# EAGLE schematic board (EAGLE 9.4.2)

## Sheet 1 of 5: Logika a konektory -ESP32 -konektor na GPS, motor zamku, vivod i2c a zbyle pinhedy pro externi pouyiti
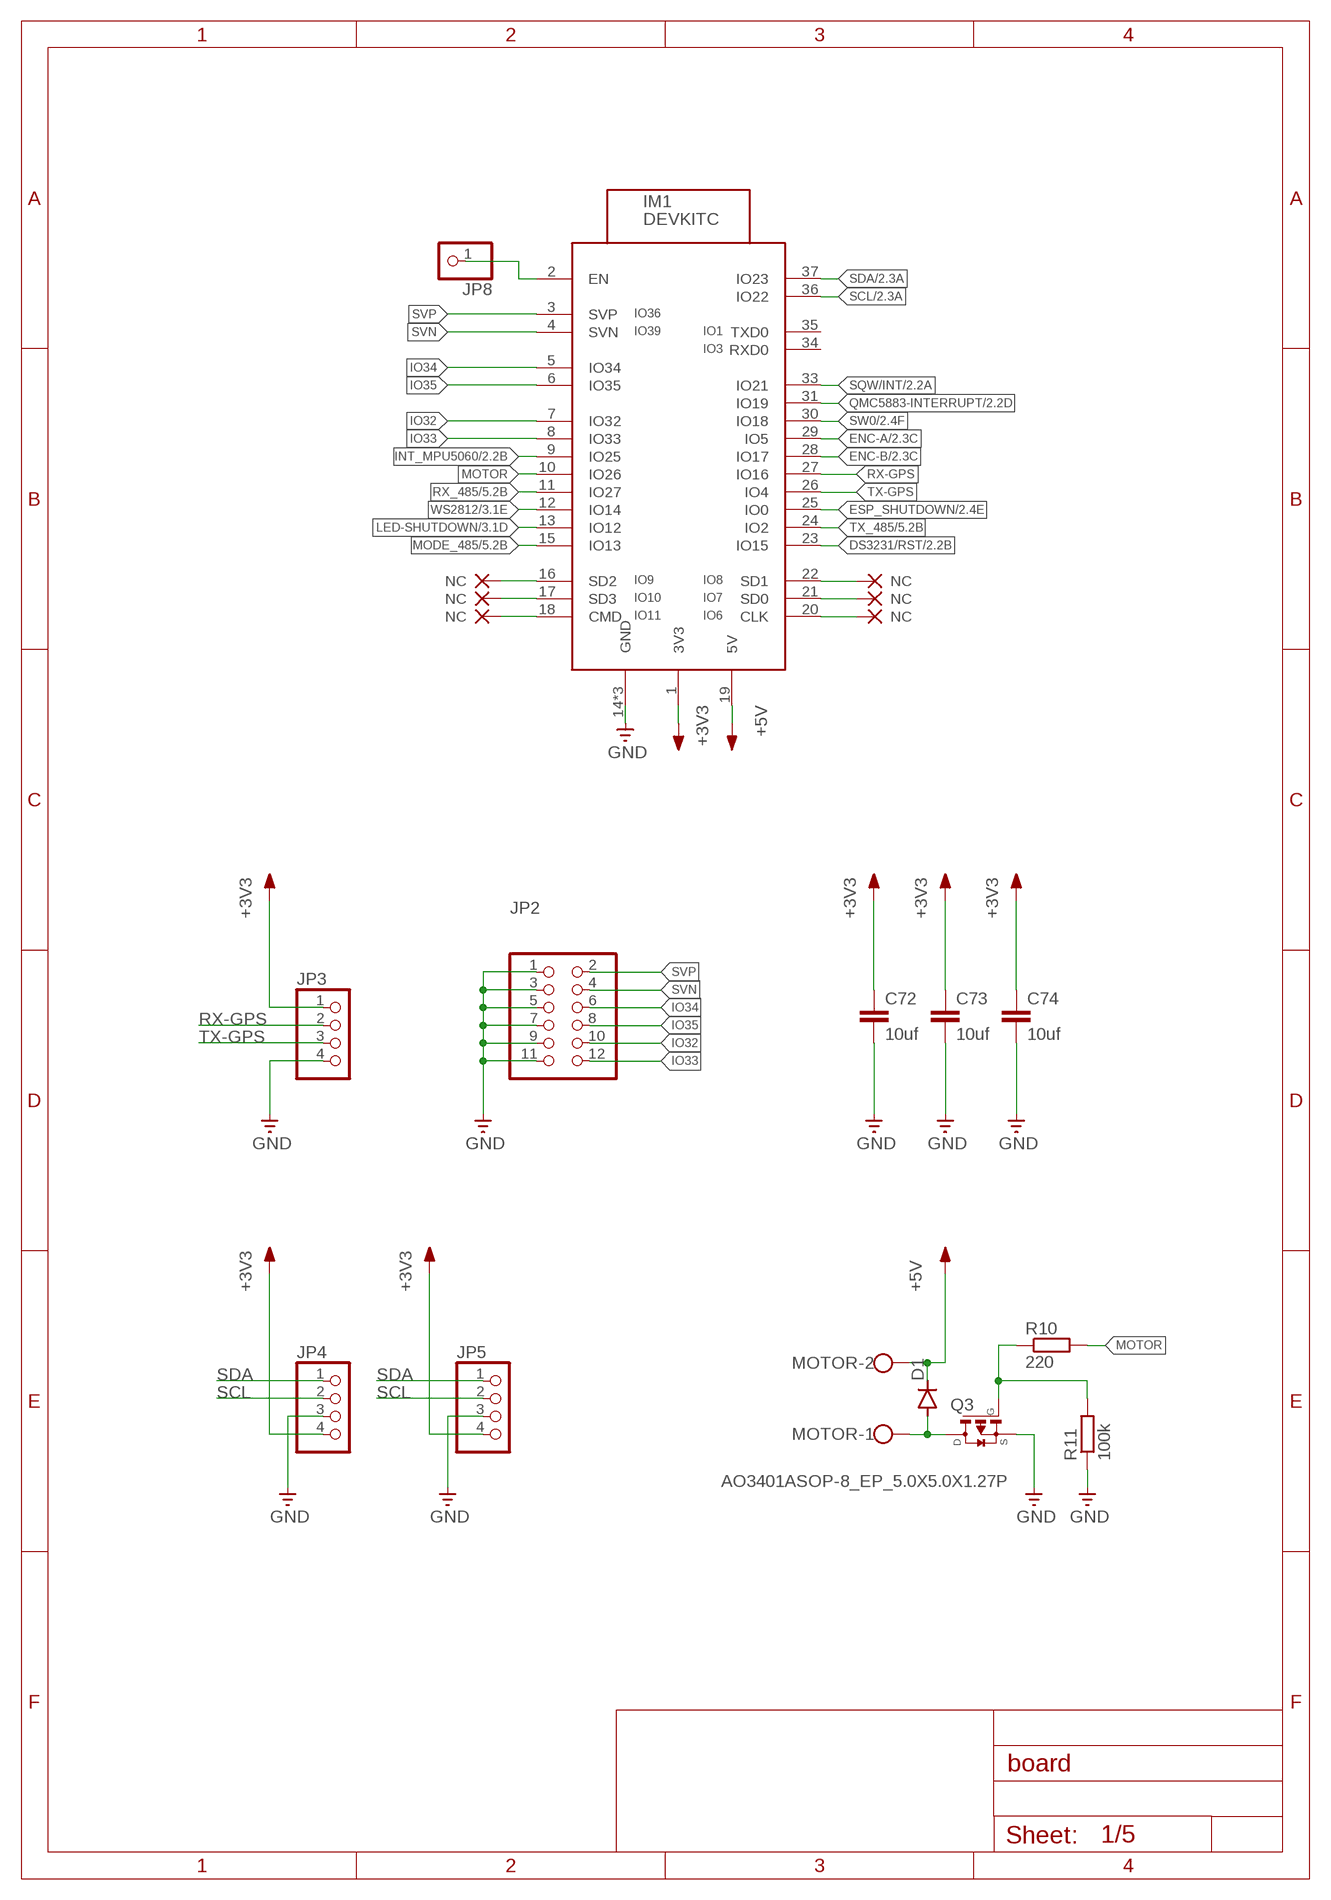
[diagram p0: schematic, sheet 1]

### Parts
C72  10uf  C-EUC0402  [C0402]
C73  10uf  C-EUC0402  [C0402]
C74  10uf  C-EUC0402  [C0402]
D1  DIODE-DO214BA  [DO214BA]
IM1  DEVKITC  [DEVKITC]
JP2  PINHD-2X6  [2X06]
JP3  PINHD-1X4  [1X04]
JP4  PINHD-1X4  [1X04]
JP5  PINHD-1X4  [1X04]
JP8  PINHD-1X1  [1X01]
MOTOR  W237-102  [W237-102]
NC1  NC  (no package)
NC2  NC  (no package)
NC3  NC  (no package)
NC4  NC  (no package)
NC5  NC  (no package)
NC6  NC  (no package)
Q3  AO3401ASOP-8_EP_5.0X5.0X1.27P  [SOP-8_EP_5.0X5.0X1.27P]
R10  220  R-EU_R0402  [R0402]
R11  100k  R-EU_R0402  [R0402]

### Nets
+3V3: C72.1 C73.1 C74.1 IM1.1(3V3) JP3.1 JP4.4 JP5.4 ; also sheet 2,3,5
+5V: D1.C IM1.19(5V) MOTOR.2 ; also sheet 2,3,5
DS3231/RST: IM1.23(IO15) ; also sheet 2
ENC-A: IM1.29(IO5) ; also sheet 2
ENC-B: IM1.28(IO17) ; also sheet 2
ESP_SHUTDOWN: IM1.25(IO0) ; also sheet 2
GND: C72.2 C73.2 C74.2 IM1.14(GND) IM1.32(GND) IM1.38(GND) JP2.1 JP2.3 JP2.5 JP2.7 JP2.9 JP2.11 JP3.4 JP4.3 JP5.3 Q3.1(S) Q3.2(S) Q3.3(S) R11.1 ; also sheet 2,3,4,5
INT_MPU5060: IM1.9(IO25) ; also sheet 2
IO9_NC: IM1.16(SD2) NC1.NC
IO9_NC1: IM1.20(CLK) NC4.NC
IO10_NC: IM1.17(SD3) NC2.NC
IO10_NC1: IM1.21(SD0) NC5.NC
IO11_NC: IM1.18(CMD) NC3.NC
IO11_NC1: IM1.22(SD1) NC6.NC
IO32: IM1.7(IO32) JP2.10
IO33: IM1.8(IO33) JP2.12
IO34: IM1.5(IO34) JP2.6
IO35: IM1.6(IO35) JP2.8
LED-SHUTDOWN: IM1.13(IO12) ; also sheet 3
MODE_485: IM1.15(IO13) ; also sheet 5
MOTOR: IM1.10(IO26) R10.2
N$2: D1.A MOTOR.1 Q3.5(D) Q3.6(D) Q3.7(D) Q3.8(D) Q3.9(D)
N$10: IM1.2(EN) JP8.1
N$71: Q3.4(G) R10.1 R11.2
QMC5883-INTERRUPT: IM1.31(IO19) ; also sheet 2
RX-GPS: IM1.27(IO16) JP3.2
RX_485: IM1.11(IO27) ; also sheet 5
SCL: IM1.36(IO22) JP4.2 JP5.2 ; also sheet 2
SDA: IM1.37(IO23) JP4.1 JP5.1 ; also sheet 2
SQW/INT: IM1.33(IO21) ; also sheet 2
SVN: IM1.4(SVN) JP2.4
SVP: IM1.3(SVP) JP2.2
SW0: IM1.30(IO18) ; also sheet 2
TX-GPS: IM1.26(IO4) JP3.3
TX_485: IM1.24(IO2) ; also sheet 5
WS2812: IM1.12(IO14) ; also sheet 3
Unconnected: IM1.34(RXD0) IM1.35(TXD0)

## Sheet 2 of 5
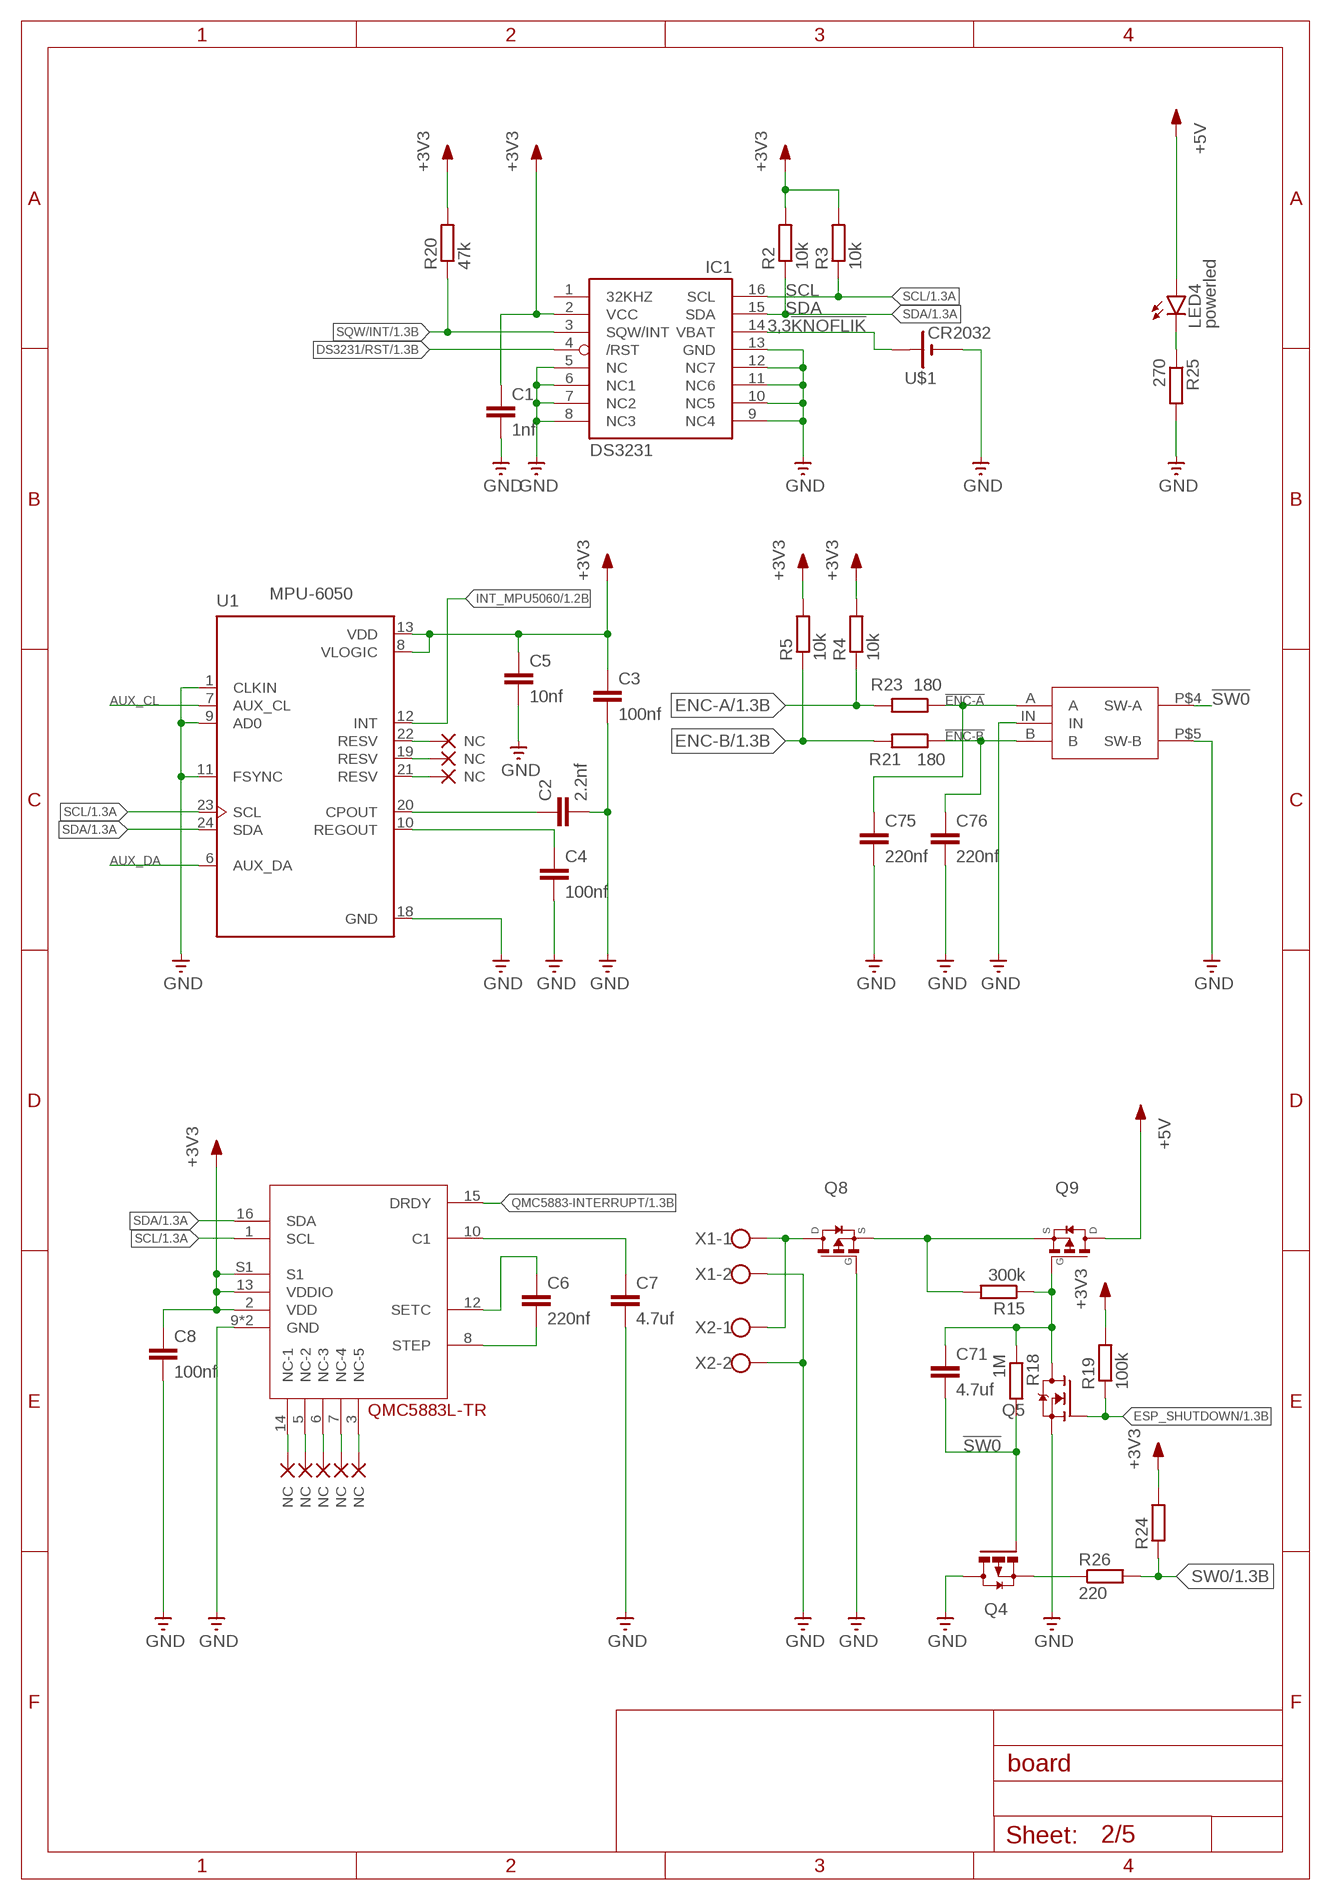
[diagram p1: schematic, sheet 2]

### Parts
C1  1nf  C-EUC0402  [C0402]
C2  2.2nf  C-EUC0402  [C0402]
C3  100nf  C-EUC0402  [C0402]
C4  100nf  C-EUC0402K  [C0402K]
C5  10nf  C-EUC0402  [C0402]
C6  220nf  C-EUC0402  [C0402]
C7  4.7uf  C-EUC0402  [C0402]
C8  100nf  C-EU  [C0402P]
C71  4.7uf  C-EUC0603  [C0603]
C75  220nf  C-EUC0402  [C0402]
C76  220nf  C-EUC0402  [C0402]
IC1  DS3231/SO  [SO16W]
IC2  QMC5883L-TR  [QMC5882L-TR]
LED4  powerled  LEDSML0603  [SML0603]
NC7  NC  (no package)
NC8  NC  (no package)
NC9  NC  (no package)
NC10  NC  (no package)
NC11  NC  (no package)
NC13  NC  (no package)
NC14  NC  (no package)
NC15  NC  (no package)
Q4  BSS84  [SOT23]
Q5  N-MOSFET-SOT23-GSD  [SOT23]
Q8  AO3401ASOP-8_EP_5.0X5.0X1.27P  [SOP-8_EP_5.0X5.0X1.27P]
Q9  AO3401ASOP-8_EP_5.0X5.0X1.27P  [SOP-8_EP_5.0X5.0X1.27P]
R2  10k  R-EU_R0402  [R0402]
R3  10k  R-EU_R0402  [R0402]
R4  10k  R-EU_R0402  [R0402]
R5  10k  R-EU_R0402  [R0402]
R15  300k  R-EU_R0603  [R0603]
R18  1M  R-EU_R0603  [R0603]
R19  100k  R-EU_R0402  [R0402]
R20  47k  R-EU_R0402  [R0402]
R21  180  R-EU_R0402  [R0402]
R23  180  R-EU_R0402  [R0402]
R24  47k  R-EU_R0402  [R0402]
R25  270  R-EU_R0402  [R0402]
R26  220  R-EU_R0402  [R0402]
U1  MPU-6050  [QFN50P400X400X95-24N]
U$1  CR2032  [CH075]
U$62  EC11-1S  [EC11-1S]
X1  W237-102  [W237-102]
X2  W237-102  [W237-102]

### Nets
3,3!KNOFLIK: IC1.14(VBAT) U$1.+
!ENC-A: C75.1 R23.1 U$62.A
!ENC-B: C76.1 R21.1 U$62.B
!SW0: C71.2 Q4.1(G) R18.2 U$62.P$4(SW-A)
+3V3: C1.1 C3.1 C5.1 C8.1 IC1.2(VCC) IC2.2(VDD) IC2.13(VDDIO) IC2.S1 R2.2 R3.2 R4.2 R5.2 R19.2 R20.2 R24.2 U1.8(VLOGIC) U1.13(VDD) ; also sheet 1,3,5
+5V: LED4.A Q9.5(D) Q9.6(D) Q9.7(D) Q9.8(D) Q9.9(D) ; also sheet 1,3,5
AUX_CL: U1.7(AUX_CL)
AUX_DA: U1.6(AUX_DA)
DS3231/RST: IC1.4(/RST) ; also sheet 1
ENC-A: R4.1 R23.2 ; also sheet 1
ENC-B: R5.1 R21.2 ; also sheet 1
ESP_SHUTDOWN: Q5.1(G) R19.1 ; also sheet 1
GND: C1.2 C2.2 C3.2 C4.2 C5.2 C7.2 C8.2 C75.2 C76.2 IC1.5(NC) IC1.6(NC1) IC1.7(NC2) IC1.8(NC3) IC1.9(NC4) IC1.10(NC5) IC1.11(NC6) IC1.12(NC7) IC1.13(GND) IC2.9(GND) IC2.11(GND) Q4.3(D) Q5.2(S) Q8.4(G) R25.2 U1.1(CLKIN) U1.9(AD0) U1.11(FSYNC) U1.18(GND) U$1.- U$62.IN U$62.P$5(SW-B) X1.2 X2.2 ; also sheet 1,3,4,5
INT_MPU5060: U1.12(INT) ; also sheet 1
IO9_NC2: IC2.5(NC-2) NC7.NC
IO9_NC3: IC2.14(NC-1) NC10.NC
IO9_NC4: NC8.NC U1.19(RESV)
IO9_NC5: NC14.NC U1.21(RESV)
IO9_NC6: IC2.3(NC-5) NC11.NC
IO9_NC7: IC2.7(NC-4) NC15.NC
IO10_NC2: IC2.6(NC-3) NC9.NC
IO10_NC4: NC13.NC U1.22(RESV)
LED4: LED4.C R25.1
N$1: C2.1 U1.20(CPOUT)
N$3: C4.1 U1.10(REGOUT)
N$4: Q8.5(D) Q8.6(D) Q8.7(D) Q8.8(D) Q8.9(D) X1.1 X2.1
N$5: Q8.1(S) Q8.2(S) Q8.3(S) Q9.1(S) Q9.2(S) Q9.3(S) R15.2
N$6: C71.1 Q5.3(D) Q9.4(G) R15.1 R18.1
N$7: Q4.2(S) R26.1
N$60: C6.1 IC2.12(SETC)
N$62: C6.2 IC2.8(STEP)
N$66: C7.1 IC2.10(C1)
QMC5883-INTERRUPT: IC2.15(DRDY) ; also sheet 1
SCL: IC1.16(SCL) IC2.1(SCL) R3.1 U1.23(SCL) ; also sheet 1
SDA: IC1.15(SDA) IC2.16(SDA) R2.1 U1.24(SDA) ; also sheet 1
SQW/INT: IC1.3(SQW/INT) R20.1 ; also sheet 1
SW0: R24.1 R26.2 ; also sheet 1
Unconnected: IC1.1(32KHZ)

## Sheet 3 of 5
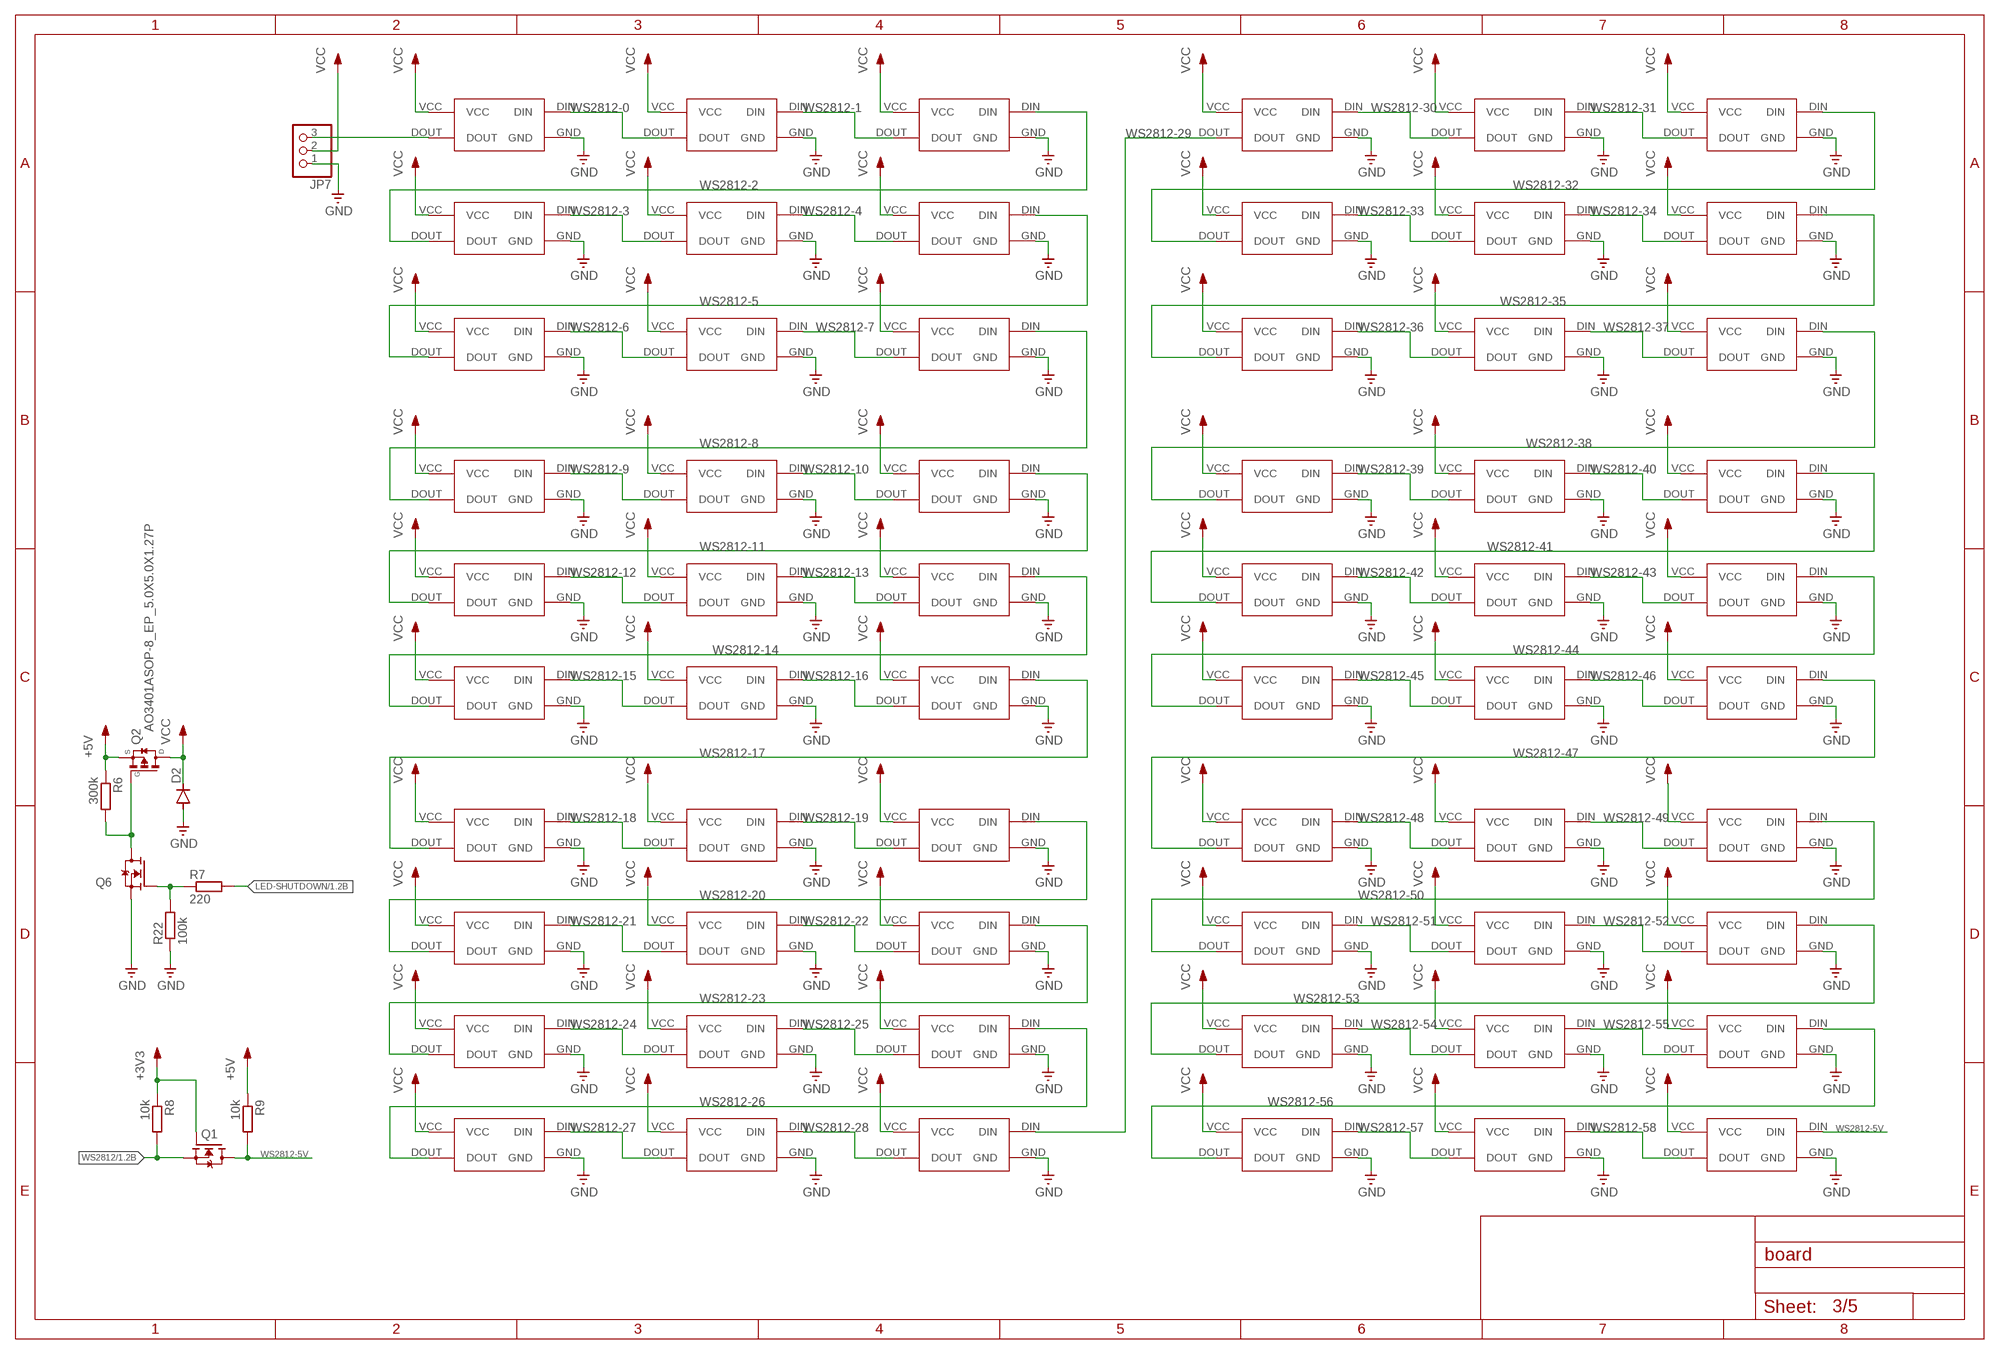
[diagram p2: schematic, sheet 3]

### Parts
D2  DIODE-DO214BA  [DO214BA]
JP7  PINHD-1X3  [1X03]
Q1  N-MOSFET-SOT23-GSD  [SOT23]
Q2  AO3401ASOP-8_EP_5.0X5.0X1.27P  [SOP-8_EP_5.0X5.0X1.27P]
Q6  N-MOSFET-SOT23-GSD  [SOT23]
R6  300k  R-EU_R0402  [R0402]
R7  220  R-EU_R0402  [R0402]
R8  10k  R-EU_R0402  [R0402]
R9  10k  R-EU_R0402  [R0402]
R22  100k  R-EU_R0402  [R0402]
U$2  WS2812  [WS2812B-MINI]
U$3  WS2812  [WS2812B-MINI]
U$4  WS2812  [WS2812B-MINI]
U$5  WS2812  [WS2812B-MINI]
U$6  WS2812  [WS2812B-MINI]
U$7  WS2812  [WS2812B-MINI]
U$8  WS2812  [WS2812B-MINI]
U$9  WS2812  [WS2812B-MINI]
U$10  WS2812  [WS2812B-MINI]
U$11  WS2812  [WS2812B-MINI]
U$12  WS2812  [WS2812B-MINI]
U$13  WS2812  [WS2812B-MINI]
U$14  WS2812  [WS2812B-MINI]
U$15  WS2812  [WS2812B-MINI]
U$16  WS2812  [WS2812B-MINI]
U$17  WS2812  [WS2812B-MINI]
U$18  WS2812  [WS2812B-MINI]
U$19  WS2812  [WS2812B-MINI]
U$20  WS2812  [WS2812B-MINI]
U$21  WS2812  [WS2812B-MINI]
U$22  WS2812  [WS2812B-MINI]
U$23  WS2812  [WS2812B-MINI]
U$24  WS2812  [WS2812B-MINI]
U$25  WS2812  [WS2812B-MINI]
U$26  WS2812  [WS2812B-MINI]
U$27  WS2812  [WS2812B-MINI]
U$28  WS2812  [WS2812B-MINI]
U$29  WS2812  [WS2812B-MINI]
U$30  WS2812  [WS2812B-MINI]
U$31  WS2812  [WS2812B-MINI]
U$32  WS2812  [WS2812B-MINI]
U$33  WS2812  [WS2812B-MINI]
U$34  WS2812  [WS2812B-MINI]
U$35  WS2812  [WS2812B-MINI]
U$36  WS2812  [WS2812B-MINI]
U$37  WS2812  [WS2812B-MINI]
U$38  WS2812  [WS2812B-MINI]
U$39  WS2812  [WS2812B-MINI]
U$40  WS2812  [WS2812B-MINI]
U$41  WS2812  [WS2812B-MINI]
U$42  WS2812  [WS2812B-MINI]
U$43  WS2812  [WS2812B-MINI]
U$44  WS2812  [WS2812B-MINI]
U$45  WS2812  [WS2812B-MINI]
U$46  WS2812  [WS2812B-MINI]
U$47  WS2812  [WS2812B-MINI]
U$48  WS2812  [WS2812B-MINI]
U$49  WS2812  [WS2812B-MINI]
U$50  WS2812  [WS2812B-MINI]
U$51  WS2812  [WS2812B-MINI]
U$52  WS2812  [WS2812B-MINI]
U$53  WS2812  [WS2812B-MINI]
U$54  WS2812  [WS2812B-MINI]
U$55  WS2812  [WS2812B-MINI]
U$56  WS2812  [WS2812B-MINI]
U$57  WS2812  [WS2812B-MINI]
U$58  WS2812  [WS2812B-MINI]
U$59  WS2812  [WS2812B-MINI]
U$60  WS2812  [WS2812B-MINI]
U$61  WS2812  [WS2812B-MINI]

### Nets
+3V3: Q1.1(G) R8.1 ; also sheet 1,2,5
+5V: Q2.1(S) Q2.2(S) Q2.3(S) R6.1 R9.1 ; also sheet 1,2,5
GND: D2.A JP7.1 Q6.2(S) R22.1 U$2.GND U$3.GND U$4.GND U$5.GND U$6.GND U$7.GND U$8.GND U$9.GND U$10.GND U$11.GND U$12.GND U$13.GND U$14.GND U$15.GND U$16.GND U$17.GND U$18.GND U$19.GND U$20.GND U$21.GND U$22.GND U$23.GND U$24.GND U$25.GND U$26.GND U$27.GND U$28.GND U$29.GND U$30.GND U$31.GND U$32.GND U$33.GND U$34.GND U$35.GND U$36.GND U$37.GND U$38.GND U$39.GND U$40.GND U$41.GND U$42.GND U$43.GND U$44.GND U$45.GND U$46.GND U$47.GND U$48.GND U$49.GND U$50.GND U$51.GND U$52.GND U$53.GND U$54.GND U$55.GND U$56.GND U$57.GND U$58.GND U$59.GND U$60.GND U$61.GND ; also sheet 1,2,4,5
LED-SHUTDOWN: R7.2 ; also sheet 1
N$9: JP7.3 U$2.DOUT
N$47: U$49.DIN U$50.DOUT
N$68: Q2.4(G) Q6.3(D) R6.2
N$69: Q6.1(G) R7.1 R22.2
VCC: D2.C JP7.2 Q2.5(D) Q2.6(D) Q2.7(D) Q2.8(D) Q2.9(D) U$2.VCC U$3.VCC U$4.VCC U$5.VCC U$6.VCC U$7.VCC U$8.VCC U$9.VCC U$10.VCC U$11.VCC U$12.VCC U$13.VCC U$14.VCC U$15.VCC U$16.VCC U$17.VCC U$18.VCC U$19.VCC U$20.VCC U$21.VCC U$22.VCC U$23.VCC U$24.VCC U$25.VCC U$26.VCC U$27.VCC U$28.VCC U$29.VCC U$30.VCC U$31.VCC U$32.VCC U$33.VCC U$34.VCC U$35.VCC U$36.VCC U$37.VCC U$38.VCC U$39.VCC U$40.VCC U$41.VCC U$42.VCC U$43.VCC U$44.VCC U$45.VCC U$46.VCC U$47.VCC U$48.VCC U$49.VCC U$50.VCC U$51.VCC U$52.VCC U$53.VCC U$54.VCC U$55.VCC U$56.VCC U$57.VCC U$58.VCC U$59.VCC U$60.VCC U$61.VCC ; also sheet 4
WS2812: Q1.2(S) R8.2 ; also sheet 1
WS2812-0: U$2.DIN U$3.DOUT
WS2812-1: U$3.DIN U$4.DOUT
WS2812-2: U$4.DIN U$5.DOUT
WS2812-3: U$5.DIN U$6.DOUT
WS2812-4: U$6.DIN U$7.DOUT
WS2812-5: U$7.DIN U$8.DOUT
WS2812-5V: Q1.3(D) R9.2 U$61.DIN
WS2812-6: U$8.DIN U$9.DOUT
WS2812-7: U$9.DIN U$10.DOUT
WS2812-8: U$10.DIN U$11.DOUT
WS2812-9: U$11.DIN U$12.DOUT
WS2812-10: U$12.DIN U$13.DOUT
WS2812-11: U$13.DIN U$14.DOUT
WS2812-12: U$14.DIN U$15.DOUT
WS2812-13: U$15.DIN U$16.DOUT
WS2812-14: U$16.DIN U$17.DOUT
WS2812-15: U$17.DIN U$18.DOUT
WS2812-16: U$18.DIN U$19.DOUT
WS2812-17: U$19.DIN U$20.DOUT
WS2812-18: U$20.DIN U$21.DOUT
WS2812-19: U$21.DIN U$22.DOUT
WS2812-20: U$22.DIN U$23.DOUT
WS2812-21: U$23.DIN U$24.DOUT
WS2812-22: U$24.DIN U$25.DOUT
WS2812-23: U$25.DIN U$26.DOUT
WS2812-24: U$26.DIN U$27.DOUT
WS2812-25: U$27.DIN U$28.DOUT
WS2812-26: U$28.DIN U$29.DOUT
WS2812-27: U$29.DIN U$30.DOUT
WS2812-28: U$30.DIN U$31.DOUT
WS2812-29: U$31.DIN U$32.DOUT
WS2812-30: U$32.DIN U$33.DOUT
WS2812-31: U$33.DIN U$34.DOUT
WS2812-32: U$34.DIN U$35.DOUT
WS2812-33: U$35.DIN U$36.DOUT
WS2812-34: U$36.DIN U$37.DOUT
WS2812-35: U$37.DIN U$38.DOUT
WS2812-36: U$38.DIN U$39.DOUT
WS2812-37: U$39.DIN U$40.DOUT
WS2812-38: U$40.DIN U$41.DOUT
WS2812-39: U$41.DIN U$42.DOUT
WS2812-40: U$42.DIN U$43.DOUT
WS2812-41: U$43.DIN U$44.DOUT
WS2812-42: U$44.DIN U$45.DOUT
WS2812-43: U$45.DIN U$46.DOUT
WS2812-44: U$46.DIN U$47.DOUT
WS2812-45: U$47.DIN U$48.DOUT
WS2812-46: U$48.DIN U$49.DOUT
WS2812-48: U$50.DIN U$51.DOUT
WS2812-49: U$51.DIN U$52.DOUT
WS2812-50: U$52.DIN U$53.DOUT
WS2812-51: U$53.DIN U$54.DOUT
WS2812-52: U$54.DIN U$55.DOUT
WS2812-53: U$55.DIN U$56.DOUT
WS2812-54: U$56.DIN U$57.DOUT
WS2812-55: U$57.DIN U$58.DOUT
WS2812-56: U$58.DIN U$59.DOUT
WS2812-57: U$59.DIN U$60.DOUT
WS2812-58: U$60.DIN U$61.DOUT

## Sheet 4 of 5
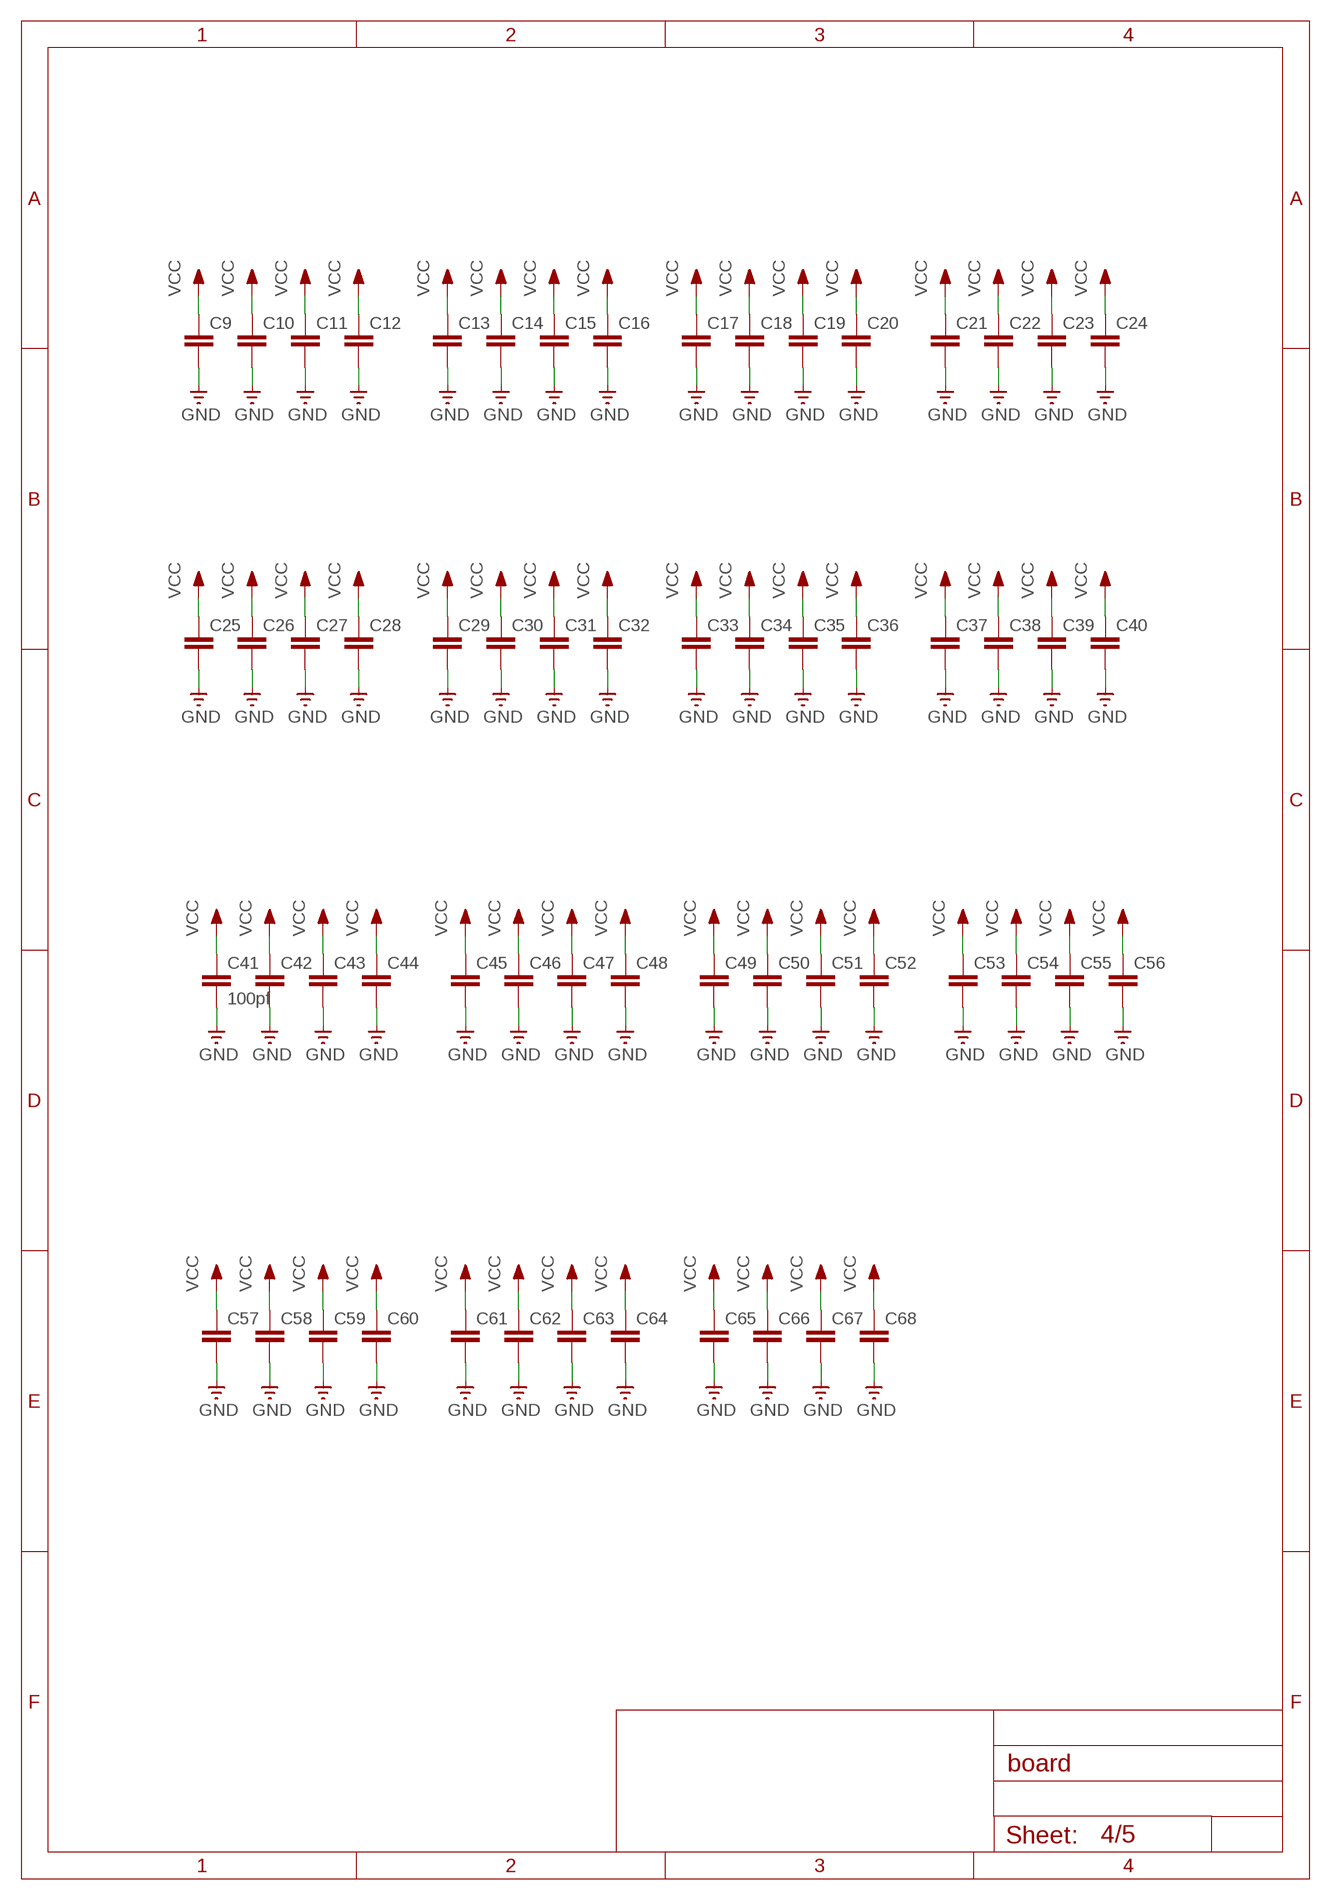
[diagram p3: schematic, sheet 4]

### Parts
C9  C-EUC0402  [C0402]
C10  C-EUC0402  [C0402]
C11  C-EUC0402  [C0402]
C12  C-EUC0402  [C0402]
C13  C-EUC0402  [C0402]
C14  C-EUC0402  [C0402]
C15  C-EUC0402  [C0402]
C16  C-EUC0402  [C0402]
C17  C-EUC0402  [C0402]
C18  C-EUC0402  [C0402]
C19  C-EUC0402  [C0402]
C20  C-EUC0402  [C0402]
C21  C-EUC0402  [C0402]
C22  C-EUC0402  [C0402]
C23  C-EUC0402  [C0402]
C24  C-EUC0402  [C0402]
C25  C-EUC0402  [C0402]
C26  C-EUC0402  [C0402]
C27  C-EUC0402  [C0402]
C28  C-EUC0402  [C0402]
C29  C-EUC0402  [C0402]
C30  C-EUC0402  [C0402]
C31  C-EUC0402  [C0402]
C32  C-EUC0402  [C0402]
C33  C-EUC0402  [C0402]
C34  C-EUC0402  [C0402]
C35  C-EUC0402  [C0402]
C36  C-EUC0402  [C0402]
C37  C-EUC0402  [C0402]
C38  C-EUC0402  [C0402]
C39  C-EUC0402  [C0402]
C40  C-EUC0402  [C0402]
C41  100pf  C-EUC0402  [C0402]
C42  C-EUC0402  [C0402]
C43  C-EUC0402  [C0402]
C44  C-EUC0402  [C0402]
C45  C-EUC0402  [C0402]
C46  C-EUC0402  [C0402]
C47  C-EUC0402  [C0402]
C48  C-EUC0402  [C0402]
C49  C-EUC0402  [C0402]
C50  C-EUC0402  [C0402]
C51  C-EUC0402  [C0402]
C52  C-EUC0402  [C0402]
C53  C-EUC0402  [C0402]
C54  C-EUC0402  [C0402]
C55  C-EUC0402  [C0402]
C56  C-EUC0402  [C0402]
C57  C-EUC0402  [C0402]
C58  C-EUC0402  [C0402]
C59  C-EUC0402  [C0402]
C60  C-EUC0402  [C0402]
C61  C-EUC0402  [C0402]
C62  C-EUC0402  [C0402]
C63  C-EUC0402  [C0402]
C64  C-EUC0402  [C0402]
C65  C-EUC0402  [C0402]
C66  C-EUC0402  [C0402]
C67  C-EUC0402  [C0402]
C68  C-EUC0402  [C0402]

### Nets
GND: C9.2 C10.2 C11.2 C12.2 C13.2 C14.2 C15.2 C16.2 C17.2 C18.2 C19.2 C20.2 C21.2 C22.2 C23.2 C24.2 C25.2 C26.2 C27.2 C28.2 C29.2 C30.2 C31.2 C32.2 C33.2 C34.2 C35.2 C36.2 C37.2 C38.2 C39.2 C40.2 C41.2 C42.2 C43.2 C44.2 C45.2 C46.2 C47.2 C48.2 C49.2 C50.2 C51.2 C52.2 C53.2 C54.2 C55.2 C56.2 C57.2 C58.2 C59.2 C60.2 C61.2 C62.2 C63.2 C64.2 C65.2 C66.2 C67.2 C68.2 ; also sheet 1,2,3,5
VCC: C9.1 C10.1 C11.1 C12.1 C13.1 C14.1 C15.1 C16.1 C17.1 C18.1 C19.1 C20.1 C21.1 C22.1 C23.1 C24.1 C25.1 C26.1 C27.1 C28.1 C29.1 C30.1 C31.1 C32.1 C33.1 C34.1 C35.1 C36.1 C37.1 C38.1 C39.1 C40.1 C41.1 C42.1 C43.1 C44.1 C45.1 C46.1 C47.1 C48.1 C49.1 C50.1 C51.1 C52.1 C53.1 C54.1 C55.1 C56.1 C57.1 C58.1 C59.1 C60.1 C61.1 C62.1 C63.1 C64.1 C65.1 C66.1 C67.1 C68.1 ; also sheet 3

## Sheet 5 of 5
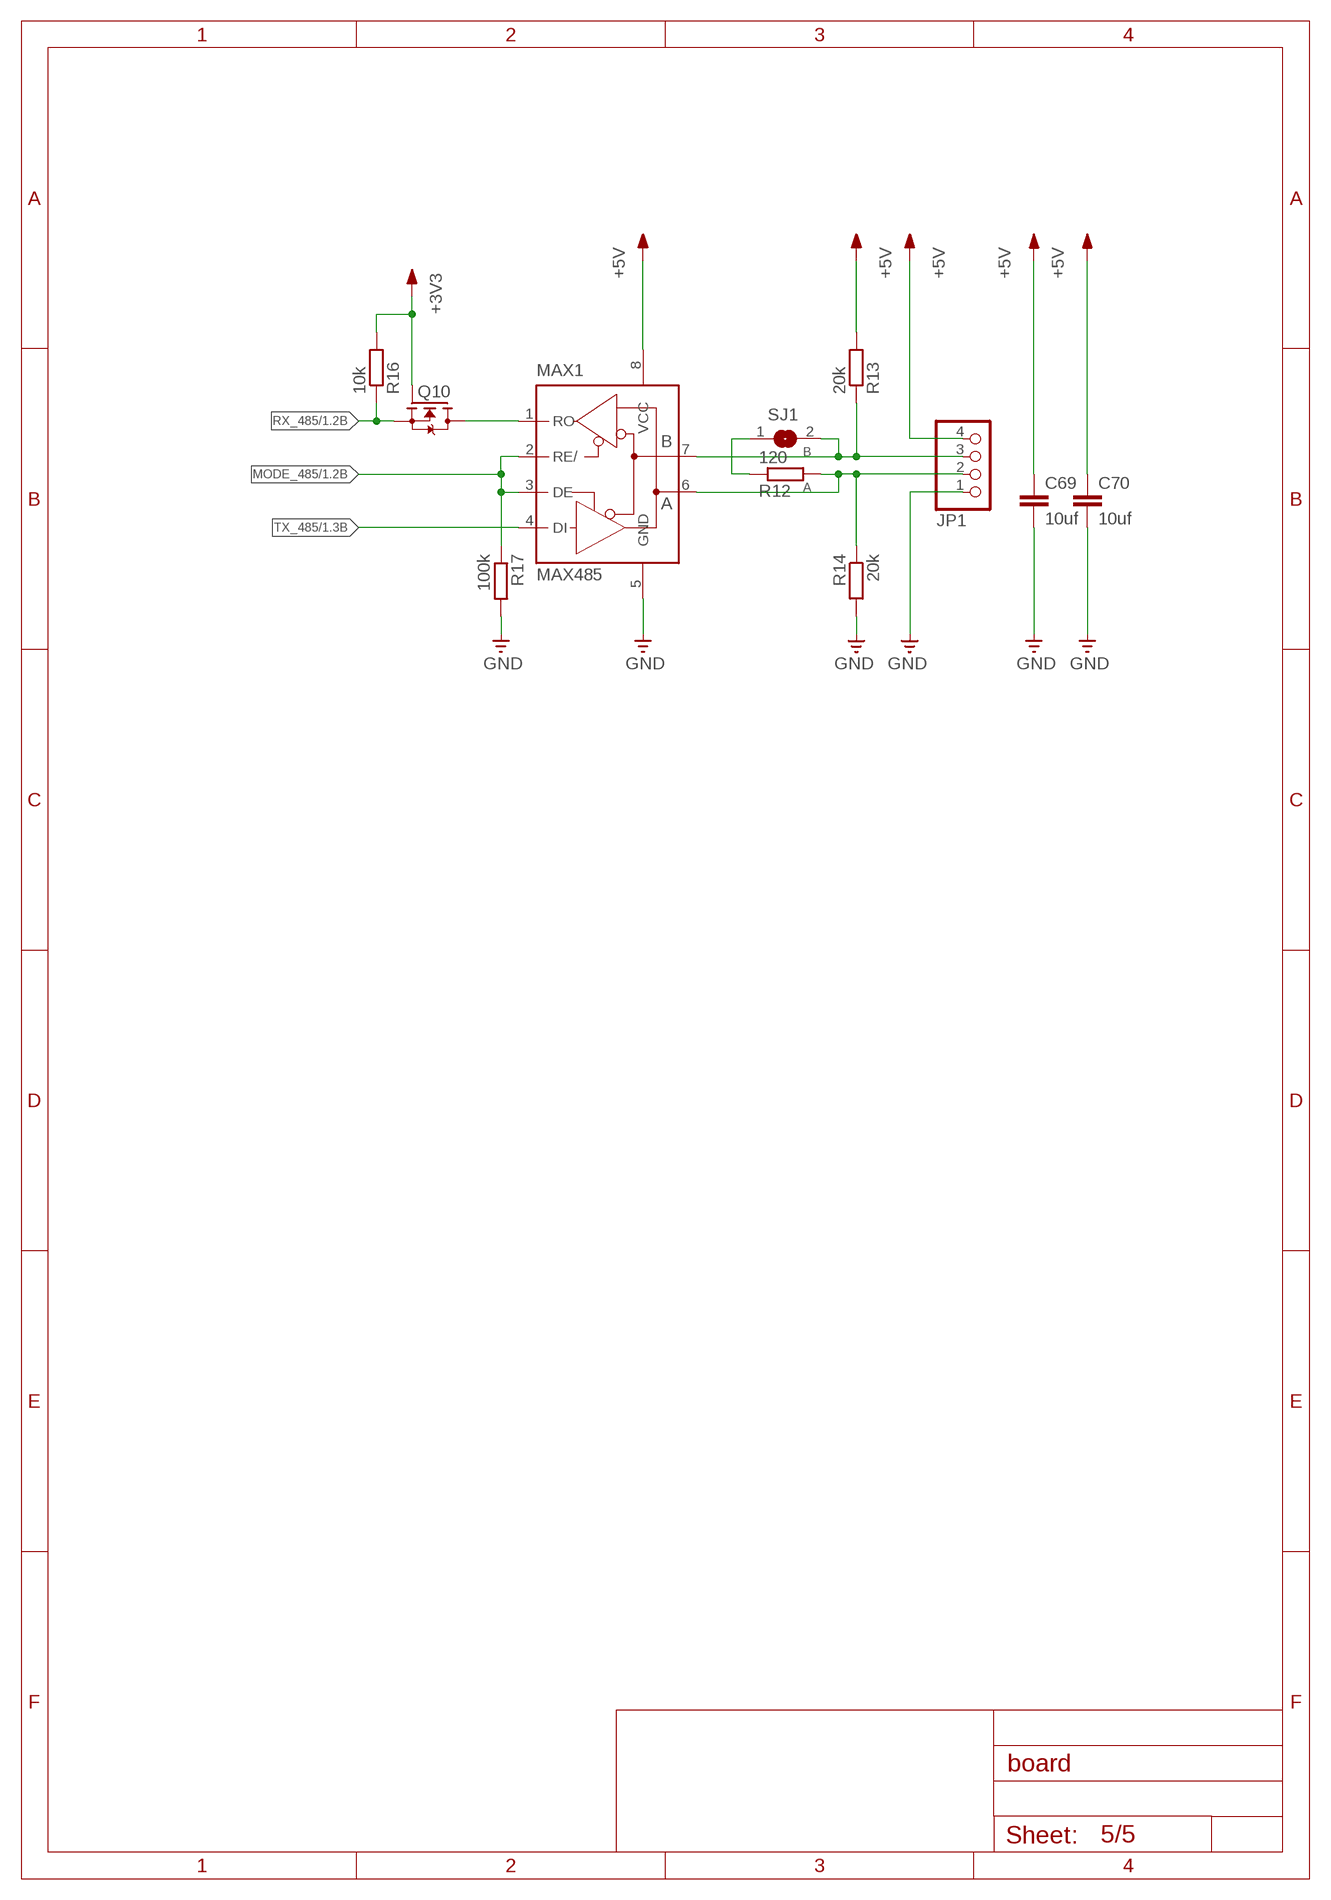
[diagram p4: schematic, sheet 5]

### Parts
C69  10uf  C-EUC0402K  [C0402K]
C70  10uf  C-EUC0402K  [C0402K]
JP1  PINHD-1X4  [1X04]
MAX1  MAX485  [SO08]
Q10  N-MOSFET-SOT23-GSD  [SOT23]
R12  120  R-EU_R0402  [R0402]
R13  20k  R-EU_R0402  [R0402]
R14  20k  R-EU_R0402  [R0402]
R16  10k  R-EU_R0402  [R0402]
R17  100k  R-EU_R0402  [R0402]
SJ1  SJ  [SJ]

### Nets
+3V3: Q10.1(G) R16.2 ; also sheet 1,2,3
+5V: C69.1 C70.1 JP1.4 MAX1.8(VCC) R13.2 ; also sheet 1,2,3
A: JP1.2 MAX1.6(A) R12.2 R14.1
B: JP1.3 MAX1.7(B) R13.1 SJ1.2
GND: C69.2 C70.2 JP1.1 MAX1.5(GND) R14.2 R17.2 ; also sheet 1,2,3,4
MODE_485: MAX1.2(RE/) MAX1.3(DE) R17.1 ; also sheet 1
N$8: R12.1 SJ1.1
RX-485-5V: MAX1.1(RO) Q10.3(D)
RX_485: Q10.2(S) R16.1 ; also sheet 1
TX_485: MAX1.4(DI) ; also sheet 1

## Library data of the parts
C1-C3 C5-C68 C71-C76 = rcl_upravena:C-EU: CAPACITOR, European symbol
C4 C69 C70 = rcl:C-EU: CAPACITOR, European symbol; SPICEPREFIX: C
D1 D2 = diode:DIODE-: DIODE
IC1 = DS3231:DS3231; AVAILABILITY: Unavailable; MF: Maxim Integrated; MP: DS3231; PACKAGE: SOIC-16 Maxim Integrated; PRICE: None
IC2 = QMC5883L-TR:QMC5883L-TR
IM1 = esp32:DEVKITC
JP1 JP3-JP5 = pinhead:PINHD-1X4: PIN HEADER
JP2 = pinhead:PINHD-2X6: PIN HEADER
JP7 = pinhead:PINHD-1X3: PIN HEADER
JP8 = pinhead:PINHD-1X1: PIN HEADER
LED4 = led:LED: LED OSRAM: - CHIPLED LG R971, LG N971, LY N971, LG Q971, LY Q971, LO R971, LY R971 LH N974, LH R974 LS Q976, LO Q976, LY Q976 LO Q996 - Hyper CHIPLED LW Q18S LB Q993, LB Q99A, LB R99A - SideLED LS A670, LO A670, LY A670, LG A670, LP A670 LB A673, LV A673, LT A673, LW A673 LH A674 LY A675 LS A676, LA A676, LO A676, LY A676, LW A676 LS A679, LY A679, LG A679 - Hyper Micro SIDELED® LS Y876, LA Y876, LO Y876, LY Y876 LT Y87S - SmartLED LW L88C, LW L88S LB L89C, LB L89S, LG L890 LS L89K, LO L89K, LY L89K LS L896, LA L896, LO L896, LY L896 - TOPLED LS T670, LO T670, LY T670, LG T670, LP T670 LSG T670, LSP T670, LSY T670, LOP T670, LYG T670 LG T671, LOG T671, LSG T671 LB T673, LV T673, LT T673, LW T673 LH T674 LS T676, LA T676, LO T676, LY T676, LB T676, LH T676, LSB T676, LW T676 LB T67C, LV T67C, LT T67C, LS T67K, LO T67K, LY T67K, LW E67C LS E67B, LA E67B, LO E67B, LY E67B, LB E67C, LV E67C, LT E67C LW T67C LS T679, LY T679, LG T679 LS T770, LO T770, LY T770, LG T770, LP T770 LB T773, LV T773, LT T773, LW T773 LH T774 LS E675, LA E675, LY E675, LS T675 LS T776, LA T776, LO T776, LY T776, LB T776 LHGB T686 LT T68C, LB T68C - Hyper Mini TOPLED® LB M676 - Mini TOPLED Santana® LG M470 LS M47K, LO M47K, LY M47K Source: http://www.osram.convergy.de LUXEON: - LUMILED® LXK2-PW12-R00, LXK2-PW12-S00, LXK2-PW14-U00, LXK2-PW14-V00 LXK2-PM12-R00, LXK2-PM12-S00, LXK2-PM14-U00 LXK2-PE12-Q00, LXK2-PE12-R00, LXK2-PE12-S00, LXK2-PE14-T00, LXK2-PE14-U00 LXK2-PB12-K00, LXK2-PB12-L00, LXK2-PB12-M00, LXK2-PB14-N00, LXK2-PB14-P00, LXK2-PB14-Q00 LXK2-PR12-L00, LXK2-PR12-M00, LXK2-PR14-Q00, LXK2-PR14-R00 LXK2-PD12-Q00, LXK2-PD12-R00, LXK2-PD12-S00 LXK2-PH12-R00, LXK2-PH12-S00 LXK2-PL12-P00, LXK2-PL12-Q00, LXK2-PL12-R00 Source: www.luxeon.com KINGBRIGHT: KA-3528ASYC Source: www.kingbright.com
MAX1 = maxim:MAX485
MOTOR X1 X2 = con-wago-500:W237-102: WAGO SCREW CLAMP; MPN: 237-102; OC_FARNELL: unknown; OC_NEWARK: 70K9898
NC1-NC11 NC13-NC15 = NC:NC: _EXTERNAL_
Q1 Q5 Q6 Q10 = transistors:N-MOSFET
Q2 Q3 Q8 Q9 = transistor-fet:AO3401A: P-Channel Enhancement MOSFET
Q4 = Transistor:BSS84: MOSFET P-CH 50V 130MA SOT-23 Manufacturer's datasheet <https://www.onsemi.com/pub/Collateral/BSS84-D.PDF>; CREATED_BY: PCBLayout.com; DIGIKEY_PART_NUMBER: BSS84CT-ND; MANUFACTURER: ON Semiconductor; MPN: BSS84; PACKAGE: SOT-23-3
R2-R24 R26 = rcl:R-EU_: RESISTOR, European symbol; SPICEPREFIX: R
R25 = resistor:R-EU_: RESISTOR, European symbol
SJ1 = jumper:SJ: SMD solder JUMPER
U1 = MPU-6050:MPU-6050: MPU-6050 Six-Axis (Gyro + Accelerometer) MEMS MotionTracking™ Devices; AVAILABILITY: Unavailable; DESCRIPTION: 3-axis gyroscope, 3-axis accelerometer in a 4x4x0.9 housing; MF: TDK InvenSense; MP: MPU-6050; PACKAGE: QFN-24 InvenSense; PRICE: None
U$1 = CR2032:CR2032
U$2-U$61 = WS2812:WS2812
U$62 = EC11-1S:EC11-1S

## Net classes
0 default: width 0.2 mm, drill 0.35 mm, clearance 0.2 mm